# EAGLE design core (EAGLE 6.4)
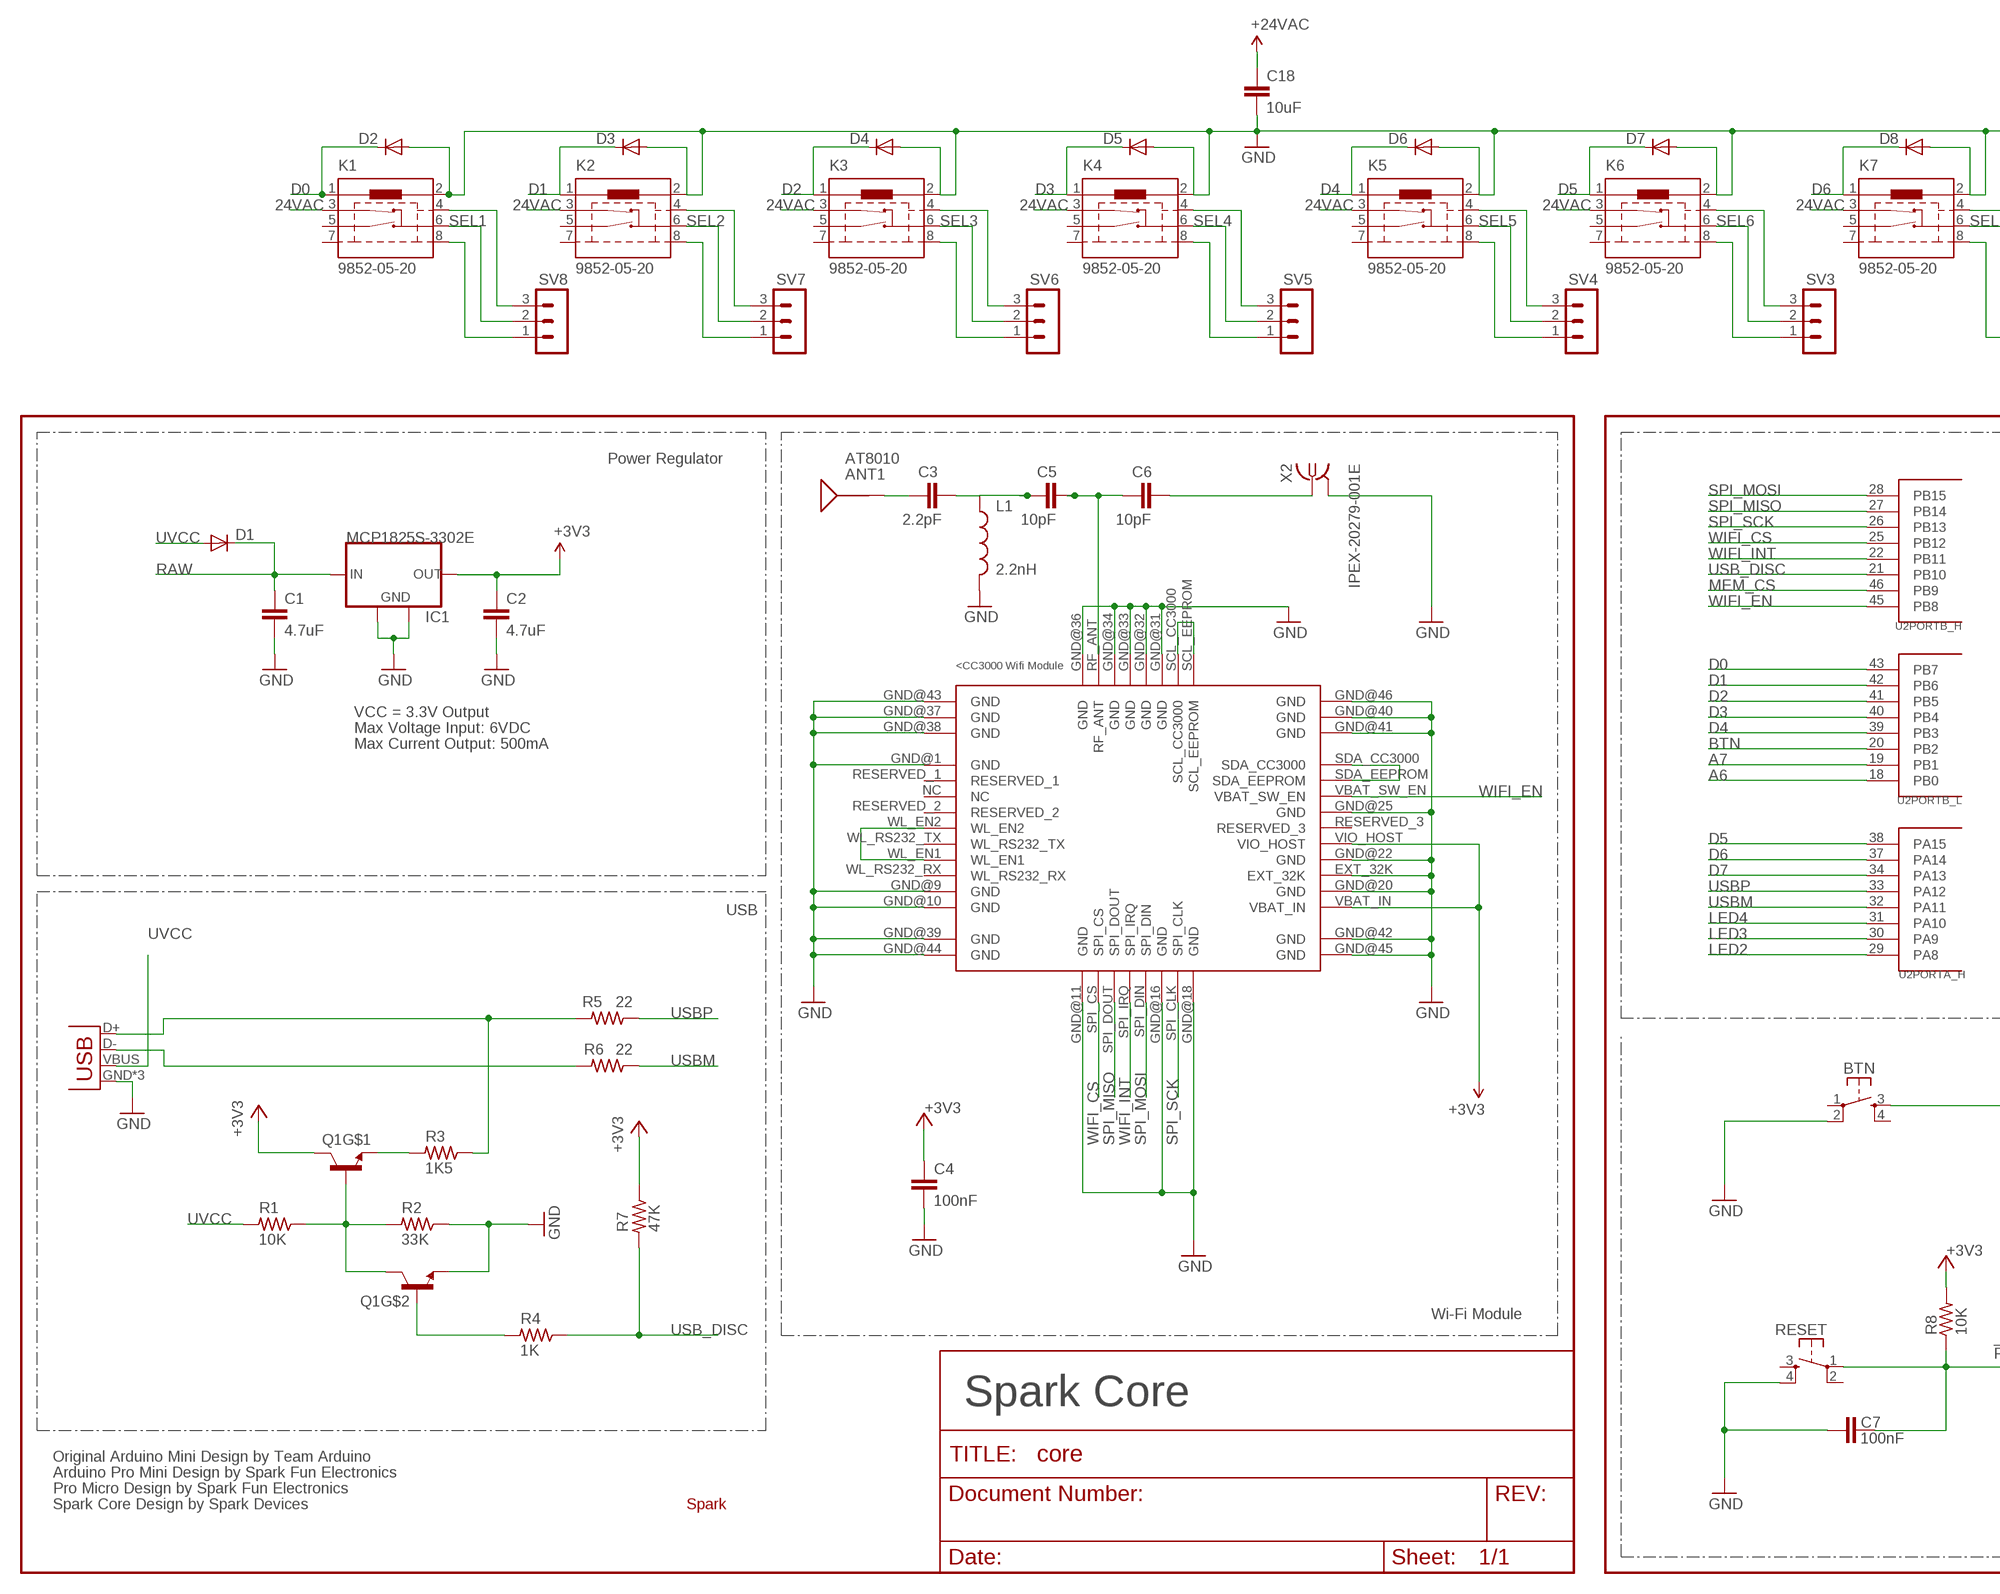
[diagram p0: schematic, sheet 1, part 1 of 2]
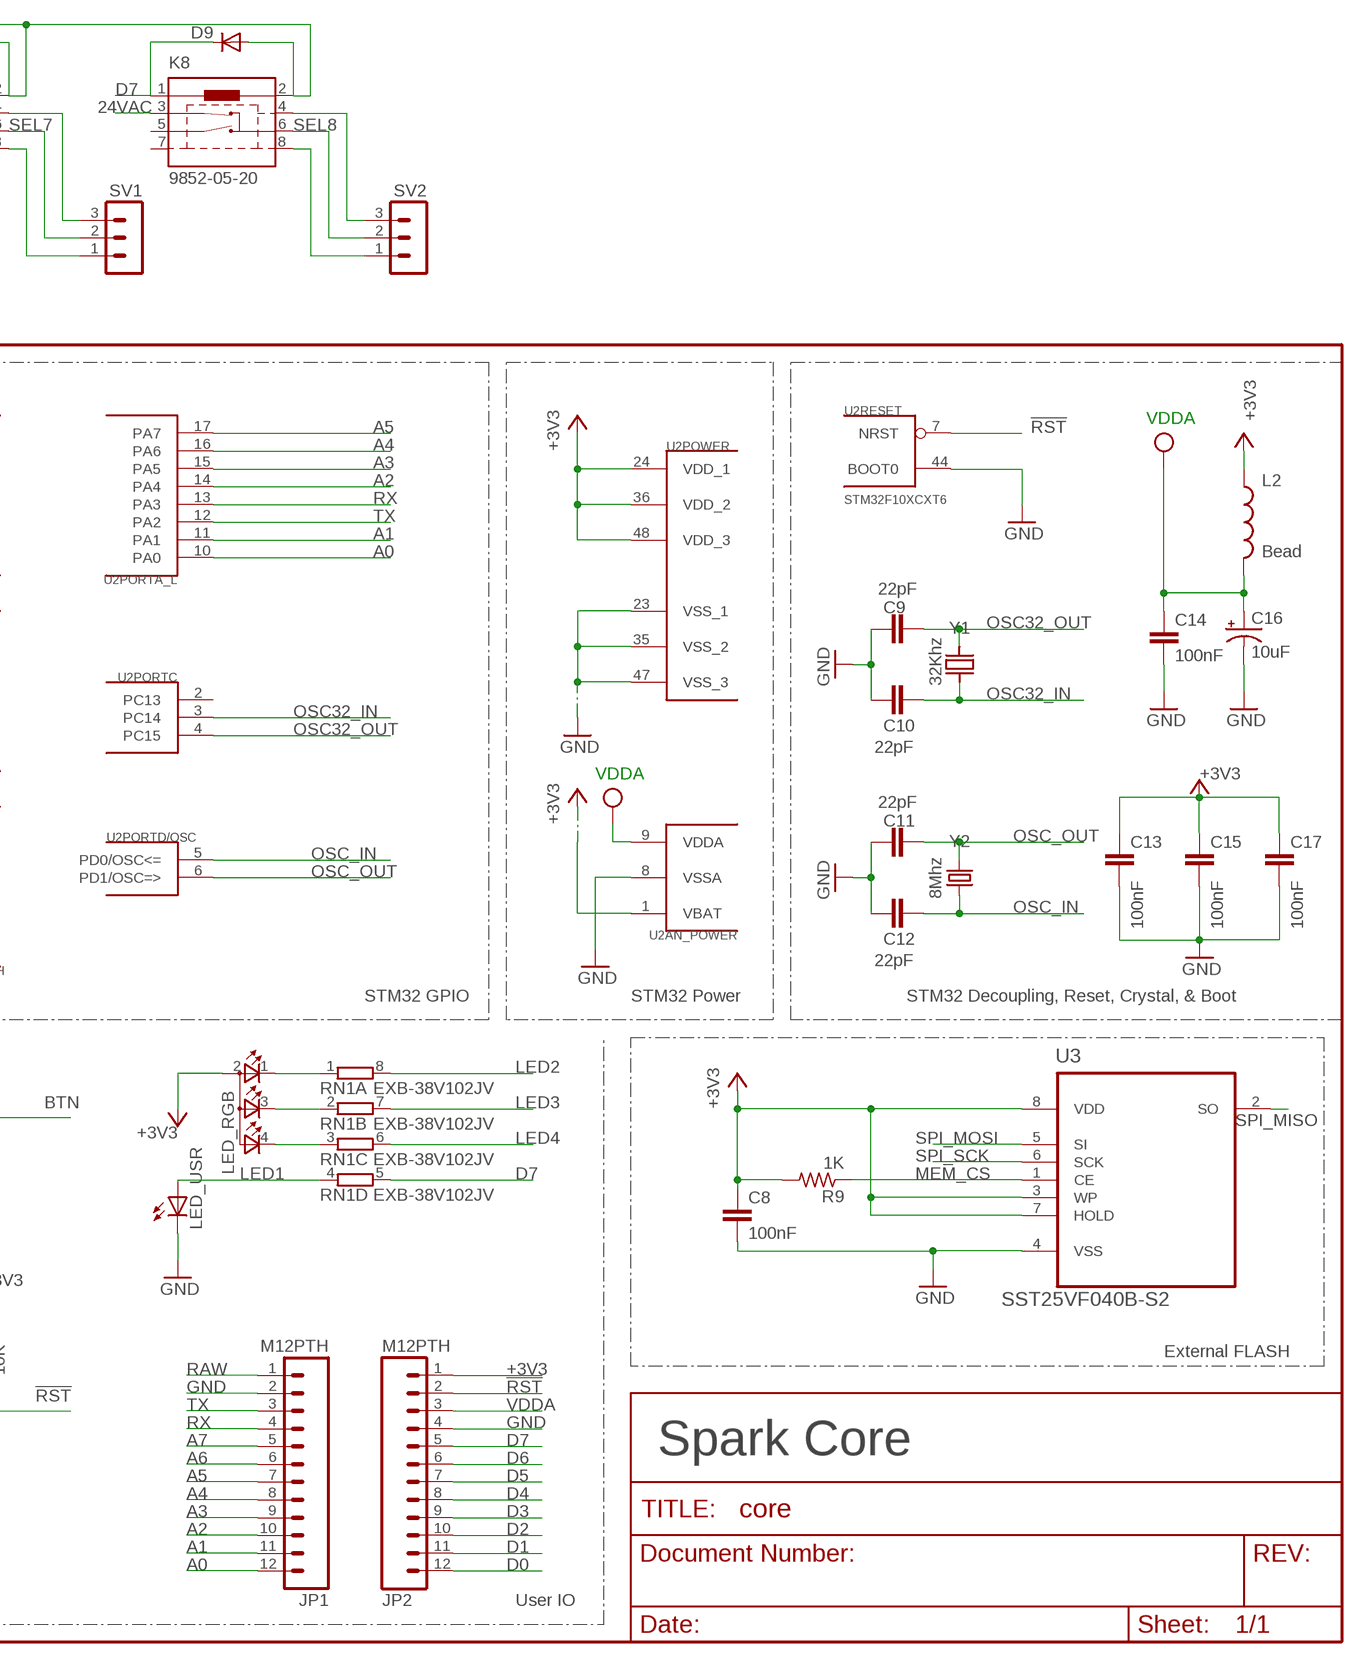
[diagram p1: schematic, sheet 1, part 2 of 2]

## Parts
ANT1  AT8010  [AT8010]
BTN  KMR211GLFS  TAC_SWITCHSMD  [TACTILE_SWITCH_SMD]
C1  4.7uF  C-EUC0603  [C0603]
C2  4.7uF  C-EUC0603  [C0603]
C3  2.2pF  C-EUC0603  [C0603]
C4  100nF  C-EUC0603  [C0603]
C5  10pF  C-EUC0603  [C0603]
C6  10pF  C-EUC0603  [C0603]
C7  100nF  C-EUC0603  [C0603]
C8  100nF  C-EUC0603  [C0603]
C9  22pF  C-EUC0603  [C0603]
C10  22pF  C-EUC0603  [C0603]
C11  22pF  C-EUC0603  [C0603]
C12  22pF  C-EUC0603  [C0603]
C13  100nF  C-EUC0603  [C0603]
C14  100nF  C-EUC0603  [C0603]
C15  100nF  C-EUC0603  [C0603]
C16  10uF  TANT-CAP1206  [EIA3216]
C17  100nF  C-EUC0603  [C0603]
C18  10uF  C-EUC0603  [C0603]
D1  DIODESOD  [SOD-323]
D2  DIODESOD  [SOD-323]
D3  DIODESOD  [SOD-323]
D4  DIODESOD  [SOD-323]
D5  DIODESOD  [SOD-323]
D6  DIODESOD  [SOD-323]
D7  DIODESOD  [SOD-323]
D8  DIODESOD  [SOD-323]
D9  DIODESOD  [SOD-323]
IC1  MCP1825S-3302E  MCP1825S-SOT223  [SOT223]
JP1  M12PTH  [1X12-SMALL-PADS]
JP2  M12PTH  [1X12-SMALL-PADS]
K1  9852-05-20  [9852-20]
K2  9852-05-20  [9852-20]
K3  9852-05-20  [9852-20]
K4  9852-05-20  [9852-20]
K5  9852-05-20  [9852-20]
K6  9852-05-20  [9852-20]
K7  9852-05-20  [9852-20]
K8  9852-05-20  [9852-20]
L1  2.2nH  INDUCTOR0603  [0603]
L2  Bead  INDUCTOR0603  [0603]
LED_RGB  TOPLED-3PLCC  [P-LCC-4-3]
LED_USR  LED0603  [LED-0603]
Q1  MMDT3904  [SOT363]
R1  10K  R-US_R0603  [R0603]
R2  33K  R-US_R0603  [R0603]
R3  1K5  R-US_R0603  [R0603]
R4  1K  R-US_R0603  [R0603]
R5  22  R-US_R0603  [R0603]
R6  22  R-US_R0603  [R0603]
R7  47K  R-US_R0603  [R0603]
R8  10K  R-US_R0603  [R0603]
R9  1K  R-US_R0603  [R0603]
RESET  KMR211GLFS  TAC_SWITCHSMD  [TACTILE_SWITCH_SMD]
RN1  EXB-38V102JV  4R-NEXB38V  [EXB38V]
SV1  MA03-1  [MA03-1]
SV2  MA03-1  [MA03-1]
SV3  MA03-1  [MA03-1]
SV4  MA03-1  [MA03-1]
SV5  MA03-1  [MA03-1]
SV6  MA03-1  [MA03-1]
SV7  MA03-1  [MA03-1]
SV8  MA03-1  [MA03-1]
U1  CC3000  [CC3000]
U2  STM32F10XCXT6  [TQFP48]
U3  SST25VF040B-S2  [SOIC127P790X216-8N]
U$1  SPARK_LOGO2  [SPARK_LOGO2]
X1  USB-MICROB  USBUSB-MICROB-SLOT-HOLE  [USB-MICROB-SLOT-HOLE]
X2  IPEX-20279-001E  [IPEX-20279-001E]
Y1  32Khz  Q_FC135  [FC135]
Y2  8Mhz  CRYSTAL5X3  [CRYSTAL-SMD-5X3]

## Nets
24VAC: C18.1 K1.3 K2.3 K3.3 K4.3 K5.3 K6.3 K7.3 K8.3 ; supply symbol labelled +24VAC
!RST: C7.2 JP2.2 R8.1 RESET.1 U2.7(RESET:NRST)
+3V3: C2.1 C4.1 C8.1 C13.1 C15.1 C17.1 IC1.3(OUT) JP2.1 L2.1 LED_RGB.2(A2) Q1.3(C) R7.1 R8.2 R9.2 U1.VBAT_IN U1.VIO_HOST U2.1(AN_POWER:VBAT) U2.24(POWER:VDD_1) U2.36(POWER:VDD_2) U2.48(POWER:VDD_3) U3.3(WP) U3.7(HOLD) U3.8(VDD)
A0: JP1.12 U2.10(PORTA_L:PA0)
A1: JP1.11 U2.11(PORTA_L:PA1)
A2: JP1.10 U2.14(PORTA_L:PA4)
A3: JP1.9 U2.15(PORTA_L:PA5)
A4: JP1.8 U2.16(PORTA_L:PA6)
A5: JP1.7 U2.17(PORTA_L:PA7)
A6: JP1.6 U2.18(PORTB_L:PB0)
A7: JP1.5 U2.19(PORTB_L:PB1)
BTN: BTN.3 U2.20(PORTB_L:PB2)
D0: D2.1(C) JP2.12 K1.1 U2.43(PORTB_L:PB7)
D1: JP2.11 K2.1 U2.42(PORTB_L:PB6)
D2: JP2.10 K3.1 U2.41(PORTB_L:PB5)
D3: JP2.9 K4.1 U2.40(PORTB_L:PB4)
D4: JP2.8 K5.1 U2.39(PORTB_L:PB3)
D5: JP2.7 K6.1 U2.38(PORTA_H:PA15)
D6: JP2.6 K7.1 U2.37(PORTA_H:PA14)
D7: JP2.5 K8.1 RN1.5 U2.34(PORTA_H:PA13)
D8: D3.1(C)
D9: D4.1(C)
D10: D5.1(C)
D11: D6.1(C)
D12: D7.1(C)
D13: D8.1(C)
D14: D9.1(C)
GND [vcc]: BTN.2 C1.2 C2.2 C4.2 C7.1 C8.2 C9.2 C10.2 C11.2 C12.2 C13.2 C14.2 C15.2 C16.C(-) C17.2 C18.2 D2.2(A) IC1.2(GND) IC1.4(GND) JP1.2 JP2.4 K1.2 K2.2 K3.2 K4.2 K5.2 K6.2 K7.2 K8.2 L1.2 LED_USR.C Q1.1(E) R2.1 RESET.4 U1.EXT_32K U1.GND@1(GND) U1.GND@9(GND) U1.GND@10(GND) U1.GND@11(GND) U1.GND@16(GND) U1.GND@18(GND) U1.GND@20(GND) U1.GND@22(GND) U1.GND@25(GND) U1.GND@31(GND) U1.GND@32(GND) U1.GND@33(GND) U1.GND@34(GND) U1.GND@36(GND) U1.GND@37(GND) U1.GND@38(GND) U1.GND@39(GND) U1.GND@40(GND) U1.GND@41(GND) U1.GND@42(GND) U1.GND@43(GND) U1.GND@44(GND) U1.GND@45(GND) U1.GND@46(GND) U2.8(AN_POWER:VSSA) U2.23(POWER:VSS_1) U2.35(POWER:VSS_2) U2.44(RESET:BOOT0) U2.47(POWER:VSS_3) U3.4(VSS) X1.GND X1.MT1(GND) X1.MT2(GND) X2.2@1(GND) X2.2@2(GND)
GND1 [vcc]: D3.2(A)
GND2 [vcc]: D4.2(A)
GND3 [vcc]: D5.2(A)
GND4 [vcc]: D6.2(A)
GND5 [vcc]: D7.2(A)
GND6 [vcc]: D8.2(A)
GND7 [vcc]: D9.2(A)
LED1: LED_USR.A RN1.4
LED2: RN1.8 U2.29(PORTA_H:PA8)
LED3: RN1.7 U2.30(PORTA_H:PA9)
LED4: RN1.6 U2.31(PORTA_H:PA10)
MEM_CS: R9.1 U2.46(PORTB_H:PB9) U3.1(CE)
N$1: R3.1 R5.2 X1.D+
N$2 [RF]: C6.2 X2.1
N$3 [RF]: ANT1.SIG(SIGNAL) C3.1
N$4 [RF]: C5.2 C6.1 U1.RF_ANT
N$5 [RF]: C3.2 C5.1 L1.1
N$6: R6.2 X1.D-
N$7: U1.SCL_CC3000 U1.SCL_EEPROM
N$8: Q1.2(B) R4.2
N$9: U1.WL_EN1 U1.WL_EN2
N$10: LED_RGB.1(CRED) RN1.1
N$12: LED_RGB.3(CBLUE) RN1.2
N$13: Q1.5(B) Q1.6(C) R1.1 R2.2
N$14: LED_RGB.4(CGREEN) RN1.3
N$15: U1.SDA_CC3000 U1.SDA_EEPROM
N$16: Q1.4(E) R3.2
N$17: K8.8 SV2.1
N$18: K8.4 SV2.3
N$19: K7.8 SV1.1
N$20: K7.4 SV1.3
N$21: K6.8 SV3.1
N$22: K6.4 SV3.3
N$23: K5.8 SV4.1
N$24: K5.4 SV4.3
N$25: K4.8 SV5.1
N$26: K4.4 SV5.3
N$27: K3.8 SV6.1
N$28: K3.4 SV6.3
N$29: K2.8 SV7.1
N$30: K2.4 SV7.3
N$31: K1.8 SV8.1
N$32: K1.4 SV8.3
OSC32_IN: C10.1 U2.3(PORTC:PC14) Y1.X1
OSC32_OUT: C9.1 U2.4(PORTC:PC15) Y1.X2
OSC_IN: C12.1 U2.5(PORTD/OSC:PD0/OSC<=) Y2.1
OSC_OUT: C11.1 U2.6(PORTD/OSC:PD1/OSC=>) Y2.3
RAW [vcc]: C1.1 D1.1(C) IC1.1(IN) JP1.1
RX: JP1.4 U2.13(PORTA_L:PA3)
SEL1: K1.6 SV8.2
SEL2: K2.6 SV7.2
SEL3: K3.6 SV6.2
SEL4: K4.6 SV5.2
SEL5: K5.6 SV4.2
SEL6: K6.6 SV3.2
SEL7: K7.6 SV1.2
SEL8: K8.6 SV2.2
SPI_MISO: U1.SPI_DOUT U2.27(PORTB_H:PB14) U3.2(SO)
SPI_MOSI: U1.SPI_DIN U2.28(PORTB_H:PB15) U3.5(SI)
SPI_SCK: U1.SPI_CLK U2.26(PORTB_H:PB13) U3.6(SCK)
TX: JP1.3 U2.12(PORTA_L:PA2)
USB_DISC: R4.1 R7.2 U2.21(PORTB_H:PB10)
USBM: R6.1 U2.32(PORTA_H:PA11)
USBP: R5.1 U2.33(PORTA_H:PA12)
UVCC: D1.2(A) R1.2 X1.VBUS
VDDA: C14.1 C16.A(+) JP2.3 L2.2 U2.9(AN_POWER:VDDA) ; supply symbol labelled VCC
WIFI_CS: U1.SPI_CS U2.25(PORTB_H:PB12)
WIFI_EN: U1.VBAT_SW_EN U2.45(PORTB_H:PB8)
WIFI_INT: U1.SPI_IRQ U2.22(PORTB_H:PB11)
Unconnected: BTN.1 BTN.4 K1.5 K1.7 K2.5 K2.7 K3.5 K3.7 K4.5 K4.7 K5.5 K5.7 K6.5 K6.7 K7.5 K7.7 K8.5 K8.7 RESET.2 RESET.3 U1.NC U1.RESERVED_1 U1.RESERVED_2 U1.RESERVED_3 U1.WL_RS232_RX U1.WL_RS232_TX U2.2(PORTC:PC13)

## Notes on the sheet
- Power Regulator
- VDDA
- VCC = 3.3V Output
- Max Voltage Input: 6VDC
- Max Current Output: 500mA
- VDDA
- USB
- STM32 GPIO | STM32 Power | STM32 Decoupling, Reset, Crystal, & Boot
- Wi-Fi Module | External FLASH
- Spark Core | Spark Core
- Original Arduino Mini Design by Team Arduino
- Arduino Pro Mini Design by Spark Fun Electronics
- Pro Micro Design by Spark Fun Electronics
- Spark Core Design by Spark Devices
- User IO

## Library data of the parts
ANT1 = Spark:AT8010: AT8010 Series Multilayer Chip Antenna
BTN RESET = Spark:TAC_SWITCH: SMD Tactiile Switch
C1-C15 C17 C18 = rcl:C-EU: CAPACITOR, European symbol
C16 = Spark:TANT-CAP: Tantalum SMT
D1-D9 = SparkFun:DIODE: Diode These are standard reverse protection diodes and small signal diodes. SMA package can handle up to about 1A. SOD-323 can handle about 200mA. What the SOD-323 package when ordering, there are some mfgs out there that are 5-pin packages.
IC1 = Spark:MCP1825S: 500 mA, Low Voltage, Low Quiescent Current LDO Regulator
JP1 JP2 = Spark:M12: Header 12 Standard 12-pin 0.1" header. Use with straight break away headers (SKU : PRT-00116), right angle break away headers (PRT-00553), swiss pins (PRT-00743), machine pins (PRT-00117), and female headers (PRT-00115).
K1-K8 = relay:9852: Surface Mount Reed Relays Source: COTO TECHNOLOGY - 9852-03-00 - RELAY - 91349.pdf; MPN: 9852-05-20; OC_FARNELL: 1081642; OC_NEWARK: 46M4523
L1 L2 = SparkFun-Passives:INDUCTOR: Inductors Basic Inductor/Choke - 0603 and 1206. Footprints are not proven and vary greatly between part numbers. SRN6045- 33uH, 20% 1.4A
LED_RGB = Spark:TOPLED-3: Cree CLVBA-FKA
LED_USR = SparkFun:LED: LEDs Standard schematic elements and footprints for 5mm, 3mm, 1206, and 0603 sized LEDs. 5mm - Spark Fun Electronics SKU : COM-00529 (and others)
Q1 = SparkFun-DiscreteSemi:MMDT3904: Dual NPN transistor
R1-R9 = rcl:R-US_: RESISTOR, American symbol
RN1 = resistor-dil:4R-N: Array Chip Resistor Source: RS Component / Phycomp; OC_FARNELL: unknown; OC_NEWARK: unknown
SV1-SV8 = con-lstb:MA03-1: PIN HEADER; OC_FARNELL: unknown; OC_NEWARK: unknown
U1 = CC3000:CC3000
U2 = stm32:STM32F10XCXT6: ST STM32F101/103 48pin LQFP
U3 = Spark:SST25VF040B: 4 Mbit SPI Serial Flash
U$1 = Spark:SPARK_LOGO2
X1 = Spark:USB
X2 = Spark:IPEX-20279-001E: Ultra Miniature Coaxial SMT RF Receptacle
Y1 = Spark:Q
Y2 = SparkFun-FreqCtrl:CRYSTAL: Various standard crystals. Proven footprints. Spark Fun Electronics SKU : COM-00534

## Net classes
2 RF: width 0.635 mm, clearance 0.762 mm

## Board
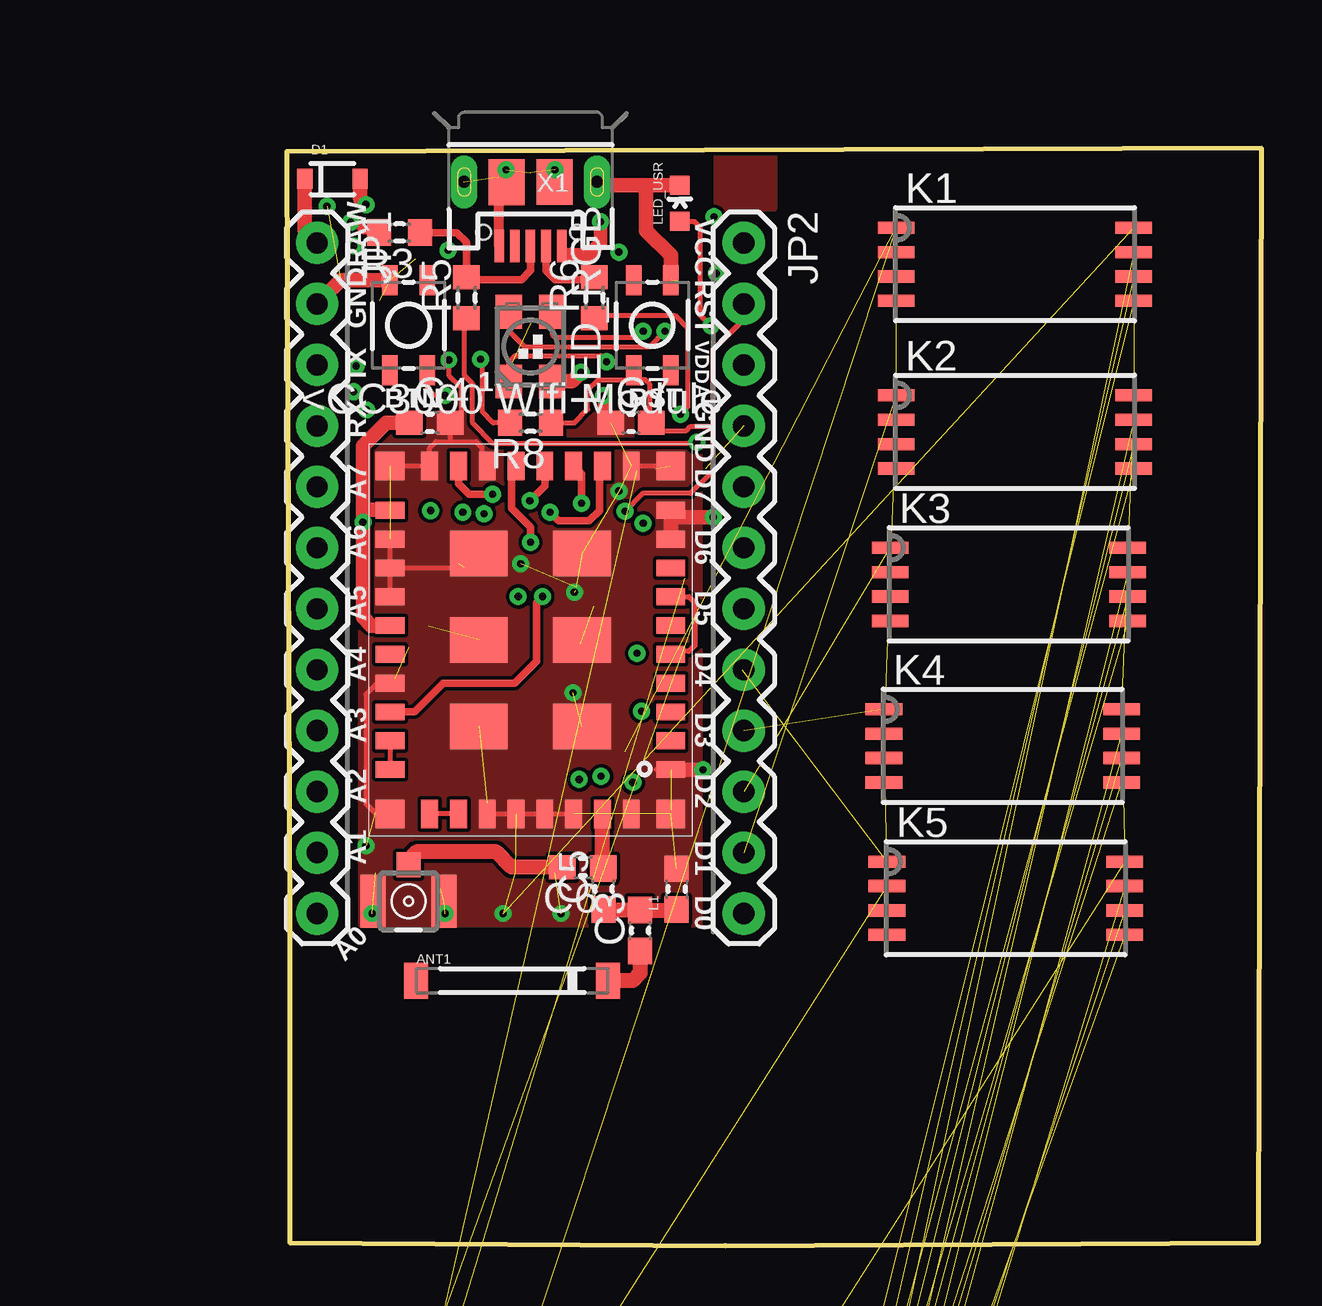
[diagram p2: board, top side]
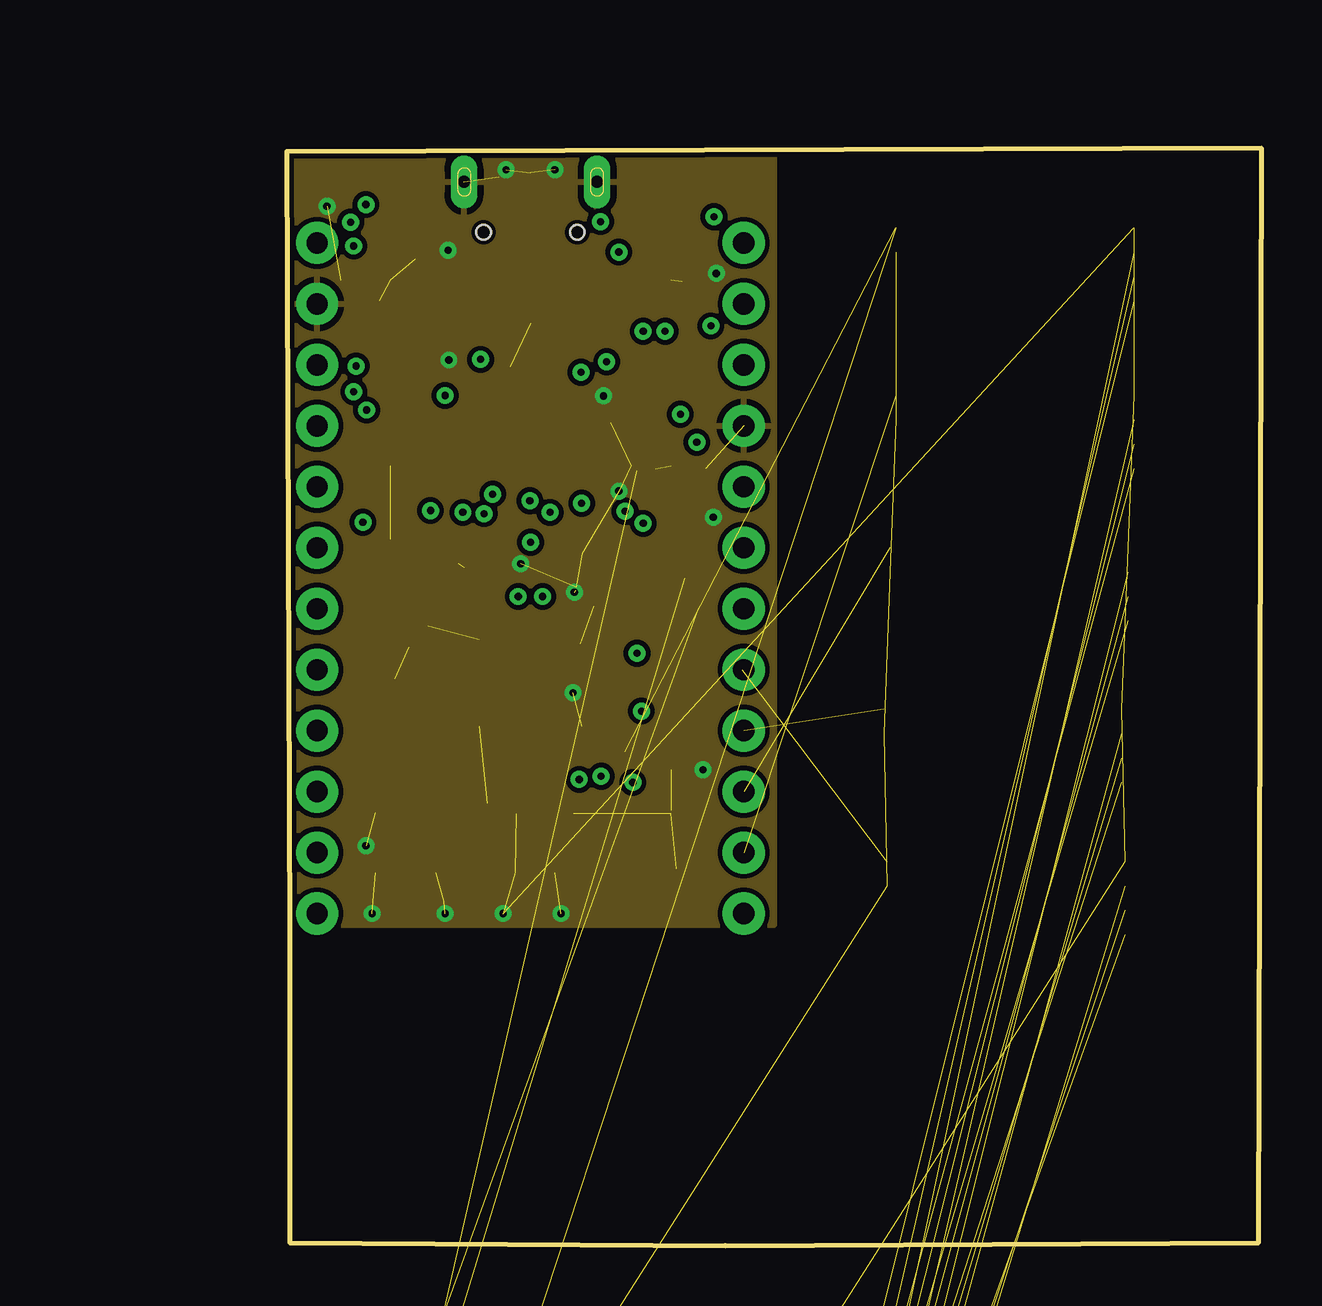
[diagram p3: board, inner layer $GND]
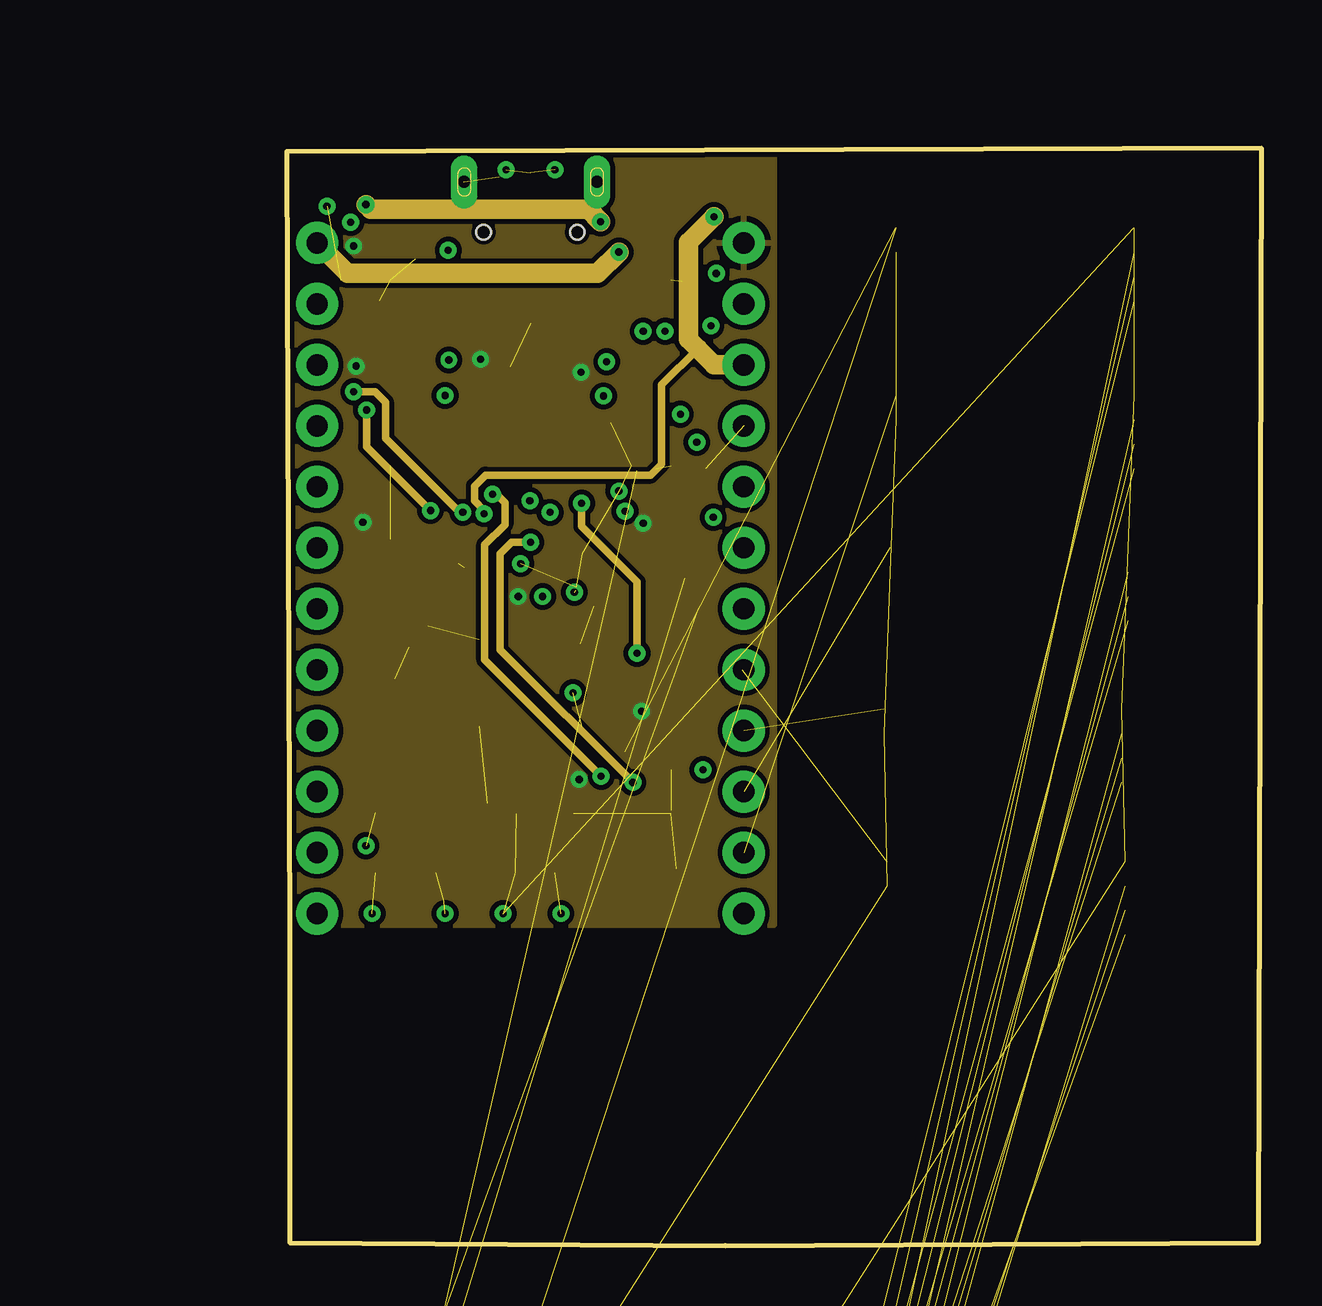
[diagram p4: board, inner layer $+3V3]
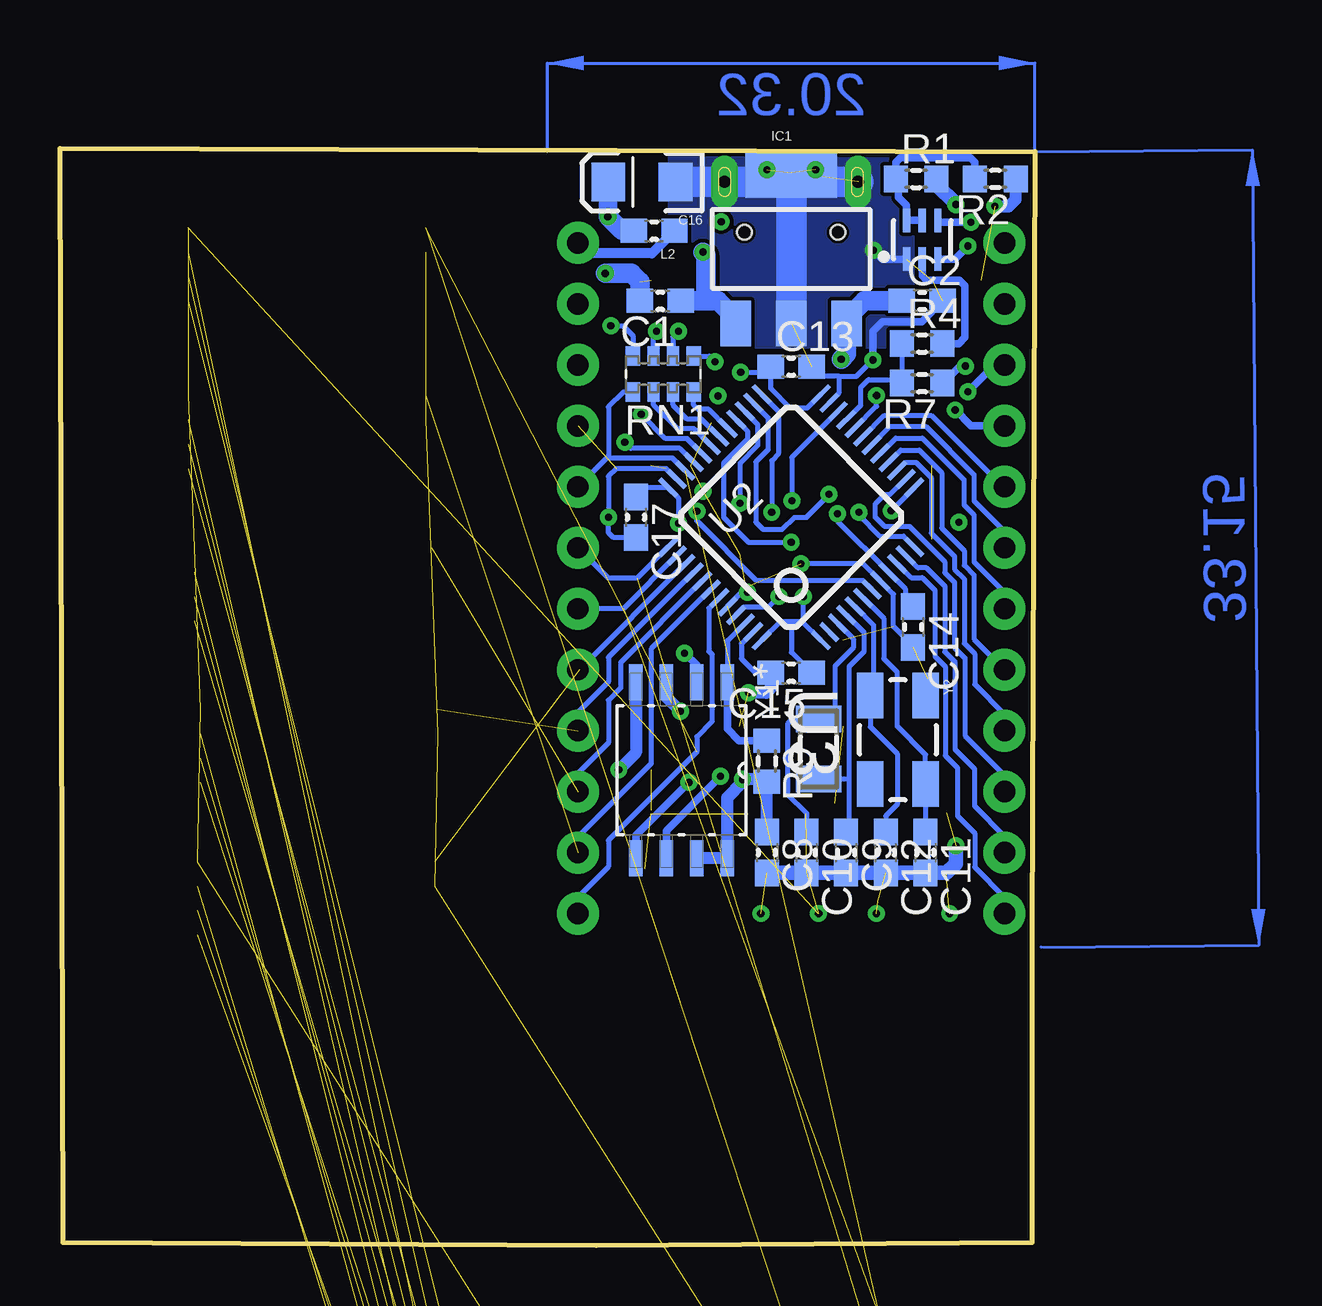
[diagram p5: board, bottom side, seen from below]

Size 40.64 x 45.72 mm. Coordinates in mm from the lower left corner, seen from the top.
Outline: 0,45.59 0.13,12.83 0.13,0.13 18.29,0 40.51,0.13 40.64,45.72 0,45.59
Copper layers (1+2*15+16): Top 0.035mm / dielectric 1.5mm / $GND 0.035mm / dielectric 0.15mm / $+3V3 0.035mm / dielectric 0.2mm / Bottom 0.035mm
Design rules "spark": minimum track width 6mil, minimum drill 0.3mm, track to track 6mil, track to pad 6mil, pad to pad 6mil, via to via 6mil, smd to smd 6mil, copper to edge 6mil, drill to drill 6mil, minimum pad ring 12mil, minimum via ring 8mil, stop-mask expansion 4mil, vias tented up to drill 20mil, thermal gap 10mil

### Footprints (pad centres in the part's own frame; a part is rotated, then mirrored left to right if it is on the bottom)
AT8010 = smd 1 x 1.5: NC -4,0; SIG 4,0
TACTILE_SWITCH_SMD = smd 1.25 x 0.65: 1 -1.875,0.775; 2 1.875,0.775; 3 -1.875,-0.775; 4 1.875,-0.775
C0603 = smd 1.1 x 1: 1 -0.85,0; 2 0.85,0
EIA3216 = smd 1.4 x 1.6: A 1.4,0; C -1.4,0
SOD-323 = smd 0.63 x 0.83: 1 -1.15,0; 2 1.15,0
SOT223 = smd 1.27 x 1.905: 1 -2.311,-3.099; 2 0,-3.099; 3 2.311,-3.099 | smd 3.81 x 1.905: 4 0,3.099
1X12-SMALL-PADS = drill 0.889 pad 1.753: 1 0,0; 2 2.54,0; 3 5.08,0; 4 7.62,0; 5 10.16,0; 6 12.7,0; 7 15.24,0; 8 17.78,0; 9 20.32,0; 10 22.86,0; 11 25.4,0; 12 27.94,0
9852-20 = smd 1.524 x 0.508: 1 -4.953,1.524; 2 4.953,1.524; 3 -4.953,0.508; 4 4.953,0.508; 5 -4.953,-0.508; 6 4.953,-0.508; 7 -4.953,-1.524; 8 4.953,-1.524
0603 = smd 1.1 x 1: 1 -0.85,0; 2 0.85,0
P-LCC-4-3 = smd 1.1 x 1.4: 1 -0.9,-1.45; 2 0.9,-1.45; 3 0.9,1.45; 4 -0.9,1.45
LED-0603 = smd 0.8 x 0.8: A 0,-0.75; C 0,0.75
SOT363 = smd 0.3 x 0.99: 1 -0.65,-0.8; 2 0,-0.8; 3 0.65,-0.8; 4 0.65,0.81; 5 0,0.81; 6 -0.65,0.81
R0603 = smd 1 x 1.1: 1 -0.85,0; 2 0.85,0
EXB38V = smd 0.6 x 0.8: 1 -1.275,-0.75; 4 1.275,-0.75; 5 1.275,0.75; 8 -1.275,0.75 | smd 0.5 x 0.8: 2 -0.4,-0.75; 3 0.4,-0.75; 6 0.4,0.75; 7 -0.4,0.75
MA03-1 = drill 1.016 long: 1 -2.54,0; 2 0,0; 3 2.54,0
CC3000 = smd 1.2 x 0.7: EXT_32K 5.85,-2.97; GND@1 -5.85,5.43; GND@9 -5.85,-4.17; GND@10 -5.85,-5.37; GND@20 5.85,-4.17; GND@22 5.85,-1.77; GND@25 5.85,1.83; NC -5.85,3.03; RESERVED_1 -5.85,4.23; RESERVED_2 -5.85,1.83; RESERVED_3 5.85,0.63; SDA_CC3000 5.85,5.43; SDA_EEPROM 5.85,4.23; VBAT_IN 5.85,-5.37; VBAT_SW_EN 5.85,3.03; VIO_HOST 5.85,-0.57; WL_EN1 -5.85,-1.77; WL_EN2 -5.85,0.63; WL_RS232_RX -5.85,-2.97; WL_RS232_TX -5.85,-0.57 | smd 0.7 x 1.2: GND@11 -4.2,-7.22; GND@16 1.8,-7.22; GND@18 4.2,-7.22; GND@31 1.8,7.28; GND@32 0.6,7.28; GND@33 -0.6,7.28; GND@34 -1.8,7.28; GND@36 -4.2,7.28; RF_ANT -3,7.28; SCL_CC3000 3,7.28; SCL_EEPROM 4.2,7.28; SPI_CLK 3,-7.22; SPI_CS -3,-7.22; SPI_DIN 0.6,-7.22; SPI_DOUT -1.8,-7.22; SPI_IRQ -0.6,-7.22 | smd 2.4 x 1.9: GND@37 -2.15,3.63; GND@38 -2.15,0.03; GND@39 -2.15,-3.57; GND@40 2.15,3.63; GND@41 2.15,0.03; GND@42 2.15,-3.57 | smd 1.2 x 1.2: GND@43 -5.85,7.28; GND@44 -5.85,-7.22; GND@45 5.85,-7.22; GND@46 5.85,7.28
TQFP48 = smd 0.2 x 1: 1 -2.75,-4.5; 2 -2.25,-4.5; 3 -1.75,-4.5; 4 -1.25,-4.5; 5 -0.75,-4.5; 6 -0.25,-4.5; 7 0.25,-4.5; 8 0.75,-4.5; 9 1.25,-4.5; 10 1.75,-4.5; 11 2.25,-4.5; 12 2.75,-4.5; 25 2.75,4.5; 26 2.25,4.5; 27 1.75,4.5; 28 1.25,4.5; 29 0.75,4.5; 30 0.25,4.5; 31 -0.25,4.5; 32 -0.75,4.5; 33 -1.25,4.5; 34 -1.75,4.5; 35 -2.25,4.5; 36 -2.75,4.5 | smd 1 x 0.2: 13 4.5,-2.75; 14 4.5,-2.25; 15 4.5,-1.75; 16 4.5,-1.25; 17 4.5,-0.75; 18 4.5,-0.25; 19 4.5,0.25; 20 4.5,0.75; 21 4.5,1.25; 22 4.5,1.75; 23 4.5,2.25; 24 4.5,2.75; 37 -4.5,2.75; 38 -4.5,2.25; 39 -4.5,1.75; 40 -4.5,1.25; 41 -4.5,0.75; 42 -4.5,0.25; 43 -4.5,-0.25; 44 -4.5,-0.75; 45 -4.5,-1.25; 46 -4.5,-1.75; 47 -4.5,-2.25; 48 -4.5,-2.75
SOIC127P790X216-8N = smd 1.499 x 0.559: 1 -3.658,1.905; 2 -3.658,0.635; 3 -3.658,-0.635; 4 -3.658,-1.905; 5 3.658,-1.905; 6 3.658,-0.635; 7 3.658,0.635; 8 3.658,1.905
USB-MICROB-SLOT-HOLE = smd 0.4 x 1.35: D+ 0,2.675; D- -0.65,2.675; GND 1.3,2.675; ID 0.65,2.675; VBUS -1.3,2.675 | drill 0.5 pad 1.1 long: MT1 -2.775,0; MT2 2.775,0 | smd 1.5 x 1.9: P$1 -1,0; P$2 1,0.01 | hole 0.6: -1.95,2.1; 1.95,2.1
IPEX-20279-001E = smd 1 x 1.05: 1 0,1.528 | smd 1.05 x 2.2: 2@1 -1.475,0; 2@2 1.475,0
FC135 = smd 1.1 x 1.9: X1 -1.25,0; X2 1.25,0
CRYSTAL-SMD-5X3 = smd 1.9 x 1.1: 1 -1.85,-1.15; 2 1.85,-1.15; 3 1.85,1.15; 4 -1.85,1.15

### Placement (x,y rotation side)
ANT1  9.4,11.05 0 top
BTN  5.08,38.35 90 top
C1  15.62,39.37 180 bottom
C2  4.7,39.37 0 bottom
C3  14.73,13.13 90 top
C4  5.97,34.29 0 top
C5  13.21,14.86 90 top
C6  12.34,15.77 180 top
C7  14.35,34.29 0 top
C8  11.18,16.38 270 bottom
C9  7.87,16.38 270 bottom
C10  9.53,16.38 270 bottom
C11  4.57,16.38 270 bottom
C12  6.22,16.38 270 bottom
C13  10.16,36.63 0 bottom
C14  5.08,25.78 270 bottom
C15  10.16,23.88 180 bottom
C16  16.38,44.32 180 bottom
C17  16.64,30.35 270 bottom
C18  -1.4,-46.35 0 top  (outside the outline)
D1  1.91,44.45 0 top
D2  -4.57,-52.32 0 top  (outside the outline)
D3  -4.57,-55.88 0 top  (outside the outline)
D4  -4.57,-58.55 0 top  (outside the outline)
D5  -4.57,-61.21 0 top  (outside the outline)
D6  -4.57,-63.88 0 top  (outside the outline)
D7  -4.57,-66.55 0 top  (outside the outline)
D8  -4.57,-69.22 0 top  (outside the outline)
D9  -4.57,-71.88 0 top  (outside the outline)
IC1  10.16,41.53 0 bottom
JP1  1.27,41.78 270 top
JP2  19.05,41.78 270 top
K1  30.35,40.89 0 top
K2  30.35,33.91 0 top
K3  30.1,27.56 0 top
K4  29.84,20.83 0 top
K5  29.97,14.48 0 top
K6  2.92,-28.07 0 top  (outside the outline)
K7  2.92,-34.8 0 top  (outside the outline)
K8  2.92,-41.53 0 top  (outside the outline)
L1  16.26,14.86 90 top
L2  15.88,42.29 180 bottom
LED_RGB  10.16,37.47 0 top
LED_USR  16.38,43.43 0 top
Q1  4.7,41.91 0 bottom
R1  4.95,44.45 0 bottom
R2  1.65,44.45 180 bottom
R3  4.7,42.21 180 top
R4  4.7,37.59 0 bottom
R5  7.49,39.5 90 top
R6  12.83,39.5 90 top
R7  4.7,35.94 180 bottom
R8  10.16,34.29 180 top
R9  11.18,20.19 270 bottom
RESET  15.24,38.35 90 top
RN1  15.49,36.32 180 bottom
SV1  -0.51,-81.79 0 top  (outside the outline)
SV2  -0.51,-76.33 0 top  (outside the outline)
SV3  -0.51,-87.25 0 top  (outside the outline)
SV4  -0.51,-92.71 0 top  (outside the outline)
SV5  -0.51,-98.17 0 top  (outside the outline)
SV6  -0.51,-103.63 0 top  (outside the outline)
SV7  -0.51,-109.09 0 top  (outside the outline)
SV8  -0.51,-114.55 0 top  (outside the outline)
U1  10.16,25.27 180 top
U2  10.16,30.35 45 bottom
U3  14.73,19.81 270 bottom
U$1  17.78,43.05 0 top
X1  10.16,44.32 180 top
X2  5.08,14.35 0 top
Y1  9.02,20.7 270 bottom
Y2  5.71,21.08 270 bottom

### Tracks (layer width: path | path; a pad name or v marks a point on that pad's centre or on a via)
24VAC  (8 unrouted)
!RST  (via drill 0.3)
  Top 0.203: 17.75,34.11 17.75,37.31 19.05,38.61 JP2.2 | 17.75,34.11 17.75,32.26 16.84,31.34 14.83,31.34 v14.1,30.61 | 17.75,34.11 17.73,34.14 16.84,34.14 16.66,33.96 15.53,33.96 C7.2 15.14,34.35 15.14,35.89 14.94,36.09 14.46,36.09 | R8.1 11.99,34.29 12.55,34.85 12.55,35.66 12.98,36.09 14.46,36.09 | 14.46,36.09 RESET.1
  Bottom 0.203: U2.7 7.17,27.71 11.61,27.71 14.1,30.2 v14.1,30.61
+3V3  (via drill 0.3)
  Top 0.203: R8.2 8.61,34.29 8.15,34.75 8.15,36.86 v8.08,36.93
  Top 0.61: U1.VIO_HOST 3.52,25.84 3.17,26.19 v3.17,30.15 3.17,30.66 | 3.17,30.66 3.17,33.33 4.14,34.29 C4.1 | U1.VBAT_IN 4.29,30.66 3.17,30.66 | LED_RGB.2 11.88,36.02 v12.27,36.4
  Bottom 0.203: U2.1 9.71,26.01 | 9.71,26.01 10.16,26.01 | 10.16,26.01 10.62,26.01 U2.48 | 10.16,26.01 10.16,24.73 C15.1 | U2.24 9.5,34.9 10.19,34.9 11.01,35.72 C13.1 11.24,36.4 v12.27,36.4 | C17.1 16.25,31.59 U2.36 14.86,31.16 v14.86,30.1 | 9.71,26.01 9.65,26.06 v9.65,27.05
  Bottom 0.305: R7.1 3.14,36.65 v2.9,36.65 | Q1.3 3.34,41.11 v2.79,41.66
  Bottom 0.406: L2.1 15.96,41.35 18.62,41.35 JP2.1
  Bottom 0.508: U3.7 U3.8 12.83,18.67 12.19,19.3 v12.19,19.43 11.6,19.43 11.34,19.18 R9.2 C8.1 | v14.78,22.28 15.37,22.86 U3.3
  Bottom 0.813: C2.1 7.11,39.37 7.85,38.63 IC1.3 7.85,37.16 v8.08,36.93
  pour $+3V3 (isolate 0.203): 0,45.59 20.32,45.59 20.32,13.34 0,13.34
A0
  Bottom 0.203: U2.10 5.17,27.84 4.7,27.84 4.17,27.3 4.17,24.56 3.73,24.13 3.73,20.42 3.23,19.91 3.23,17.91 2.52,17.2 2.52,15.77 1.27,14.53 JP1.12
A1
  Bottom 0.203: U2.11 4.87,28.25 4.52,28.25 3.76,27.48 3.76,24.74 3.33,24.31 3.33,20.68 2.52,19.86 2.52,18.31 1.27,17.07 JP1.11
A2
  Bottom 0.203: U2.14 6.04,31.29 6.27,31.29 6.66,30.91 6.66,30.35 6.27,29.97 5.23,29.97 3.76,28.5 3.76,28.04 3.35,27.63 3.35,24.92 2.92,24.49 2.92,21.26 1.27,19.61 JP1.10
A3
  Bottom 0.203: U2.15 5.4,32.64 4.95,32.64 4.32,32 4.32,29.69 3.35,28.73 3.35,28.19 2.95,27.79 2.95,25.09 2.52,24.66 2.52,23.39 1.27,22.15 JP1.9
A4
  Bottom 0.203: U2.16 5.6,33.15 4.83,33.15 3.89,32.21 3.89,29.9 2.95,28.96 2.95,28.35 2.54,27.94 2.54,25.27 JP1.8
A5
  Bottom 0.203: U2.17 5.8,33.66 4.7,33.66 2.95,31.9 2.95,30.86 2.54,30.46 2.54,28.5 1.27,27.23 JP1.7
A6
  Bottom 0.203: U2.18 6.02,34.14 4.55,34.14 2.54,32.13 2.54,31.04 1.27,29.77 JP1.6
A7
  Bottom 0.203: U2.19 6.27,34.59 4.32,34.59 1.35,31.62 JP1.5
BTN  (via drill 0.3)
  Top 0.203: 5.84,36.47 BTN.3 5.87,36.47 5.87,35.69 6.13,35.43 v6.6,35.43
  Bottom 0.203: U2.20 6.6,34.97 v6.6,35.43
D0  (2 unrouted)
  Bottom 0.203: JP2.12 19.05,14.53 17.78,15.8 17.78,16.89 14.1,20.57 14.1,21.21 13.46,21.84 13.46,24.64 13.59,24.77 13.59,26.57 U2.43
D1  (1 unrouted)
  Bottom 0.203: U2.42 16,24.87 16,20.09 19.05,17.04 JP2.11
D2  (1 unrouted)
  Bottom 0.203: U2.41 17.27,24.3 17.27,23.24 17.78,22.73 17.78,20.95 19.05,19.69 JP2.10
D3  (1 unrouted)
  Bottom 0.203: U2.40 17.77,24.51 17.78,24.51 17.78,23.5 19.05,22.23 JP2.9
D4  (1 unrouted)
  Bottom 0.203: U2.39 18.98,24 JP2.8
D5  (1 unrouted)
  Bottom 0.203: U2.38 17.15,26.54 JP2.7
D6  (1 unrouted)
  Bottom 0.203: U2.37 16.59,27.81 17.78,27.81 JP2.6
D7  (1 unrouted)
  Bottom 0.203: U2.34 15.1,32.82 17.86,32.82 | RN1.5 17.16,35.57 17.78,34.95 17.78,32.89 17.86,32.82 | 17.86,32.82 JP2.5
GND  (via drill 0.3)  (47 unrouted)
  Top 0.203: U1.GND@43 16.01,18.15 | U1.GND@1 15.4,19.84 | U1.GND@34 U1.GND@33 U1.GND@32 U1.GND@31 8.36,18.44 | U1.GND@22 U1.EXT_32K | U1.GND@45 U1.GND@18 | U1.GND@38 12.41,25.15 | U1.GND@25 4.49,23.62 3.94,23.62 3.3,22.99 3.3,18.41 3.68,18.03 4.27,18.03 U1.GND@46 | U1.GND@11 U1.GND@44 | U1.EXT_32K U1.GND@20 | U1.EXT_32K 7.41,28.24 U1.GND@42 | U1.GND@18 | 8.26,32 8.26,32.39 U1.GND@16 8.13,32.73 8.13,33.27 7.9,33.5 6.83,33.5 | U1.GND@18 5.96,33.24 6.22,33.5 6.83,33.5 | 6.83,33.5 6.82,33.52 C4.2 7.26,34.73 7.26,35.76 6.76,36.27 v6.76,36.91 | 12.06,27.3 12.06,27.43
  Top 0.406: X1.GND 8.86,44.55 v9.14,44.83
  Top 0.508: v13.21,35.41 13.21,34.58 C7.1
  Top 0.61: U1.GND@1 v17.34,19.84 v17.35,19.84 | U1.GND@9 U1.GND@10 16.3,30.35 v17.78,30.35 | RESET.4 16.02,41.26 14.99,42.29 14.99,44.18 | LED_USR.C 14.99,44.18 | 14.99,44.18 13.07,44.18 X1.MT1 | BTN.2 2.26,40.23 JP1.2
  Bottom 0.203: U2.35 15.37,32.39 17.45,32.39 17.78,32.05 v17.78,30.35 17.78,29.72 17.57,29.5 C17.2 | U2.47 12.24,25.09 12.24,24.46 11.66,23.88 C15.2 | 8.15,36.22 7.44,36.22 v6.76,36.91 | U2.23 8.15,35.54 8.15,36.22 | C14.2 5.08,24.99 5.89,25.81 5.89,27.15 U2.8 7.17,28.42 v9.75,28.42 | 8.15,36.22 8.9,36.22 C13.2 | U2.44 12.22,27.23 v11.99,27.23
  Bottom 0.305: 10.16,44.7 IC1.4 | Q1.1 6.36,41.11 v6.73,41.48 | C2.2 4.71,38.51 6.35,38.51 6.76,38.1 v6.76,36.91
  Bottom 0.508: U3.4 16.64,20.55 v17.35,19.84 | v11.94,23.04 11.2,23.04 11.01,23.23 C15.2 | v1.68,43.31 1.09,43.31 0.8,43.6 R2.1 0.81,44.44
  Bottom 0.61: C8.2 C10.2 C9.2 C12.2 C11.2 3.69,15.53 3.3,15.93 v3.3,16.66
  Bottom 0.813: C1.2 16.47,40.17 16.82,40.51 v17.91,40.51 | 10.16,44.83 IC1.4
  Bottom 1.27: IC1.2 IC1.4 | 7.37,44.32 X1.MT1 C16.C
  other vias: 3.56,13.84 6.6,13.84 9.02,13.84 11.43,13.84 13.84,31.45 11.18,44.83
  pour $GND (isolate 0.203): 0,45.59 20.32,45.59 20.32,13.34 0,13.34
  pour Top (no thermals): 3.05,13.34 3.05,34.67 17.27,34.67 17.27,13.34
  pour Bottom (no thermals): 5.08,45.59 15.24,45.59 15.24,37.47 5.08,37.47
LED1  (via drill 0.3)
  Top 0.203: LED_USR.A 16.98,42.68 17.22,42.44 17.22,38.79 v17.68,38.33
  Bottom 0.203: v17.68,38.33 17.17,38.33 16.76,37.92 RN1.4
LED2
  Bottom 0.203: U2.29 13.6,34.85 14.05,34.85 14.22,35.03 RN1.8
LED3
  Bottom 0.203: U2.30 13.9,34.44 14.5,34.44 15.09,35.03 RN1.7
LED4
  Bottom 0.203: U2.31 14.2,34.04 14.91,34.04 15.9,35.03 RN1.6
MEM_CS
  Bottom 0.203: U2.46 12.83,25.21 U3.1
  Bottom 0.305: U3.1 12.83,21.54 12.33,21.04 R9.1
N$1
  Top 0.305: R3.1 7.09,42.22 7.49,41.81 R5.2 7.58,40.26 9.78,40.26 10.16,40.64 X1.D+
N$2
  Top 0.635: C6.2 9.37,15.77 8.74,16.41 5.4,16.41 5.08,16.09 X2.1
N$3
  Top 0.635: C3.1 14.73,11.37 14.41,11.05 ANT1.SIG
N$4
  Top 0.406: 13.21,15.77 C6.1
  Top 0.635: C6.1 13.16,15.81 U1.RF_ANT | 13.21,15.77 C5.2
N$5
  Top 0.635: C5.1 14.71,14.01 C3.2 16.23,13.98 L1.1
N$6
  Top 0.305: R6.2 12.74,40.26 11.18,40.26 10.81,40.62 X1.D-
N$7
  Top 0.203: U1.SCL_CC3000 U1.SCL_EEPROM
N$8
  Bottom 0.305: Q1.2 4.7,40.41 4.52,40.23 3.15,40.23 2.92,40 2.92,37.85 3.17,37.59 R4.2
N$9
  Top 0.203: U1.WL_EN1 16.77,27.04 17.02,26.8 17.02,25.02 16.76,24.77 16.13,24.77 U1.WL_EN2
N$10  (via drill 0.3)
  Top 0.203: LED_RGB.1 9.26,36.82 9.53,37.08 13.08,37.08 v13.34,36.83
  Bottom 0.203: RN1.1 13.58,37.07 v13.34,36.83
N$11
  pour Top: 17.91,45.59 20.32,45.59 20.32,43.18 17.91,43.18
N$12  (via drill 0.3)
  Top 0.203: LED_RGB.3 11.06,37.96 11.18,37.85 14.61,37.85 v14.86,38.1
  Bottom 0.203: v14.86,38.1 15.09,37.87 RN1.2
N$13
  Bottom 0.305: Q1.5 Q1.6 5.35,43.35 5.69,43.69 5.69,44.34 R1.1 5.8,45.15 5.61,45.34 2.69,45.34 2.5,45.15 R2.2
N$14  (via drill 0.3)
  Top 0.203: LED_RGB.4 9.26,38.11 9.91,37.47 15.14,37.47 v15.77,38.1
  Bottom 0.203: RN1.3 15.89,37.98 v15.77,38.1
N$15
  Top 0.203: U1.SDA_EEPROM U1.SDA_CC3000
N$16  (via drill 0.3)
  Top 0.305: 3.76,42.22 R3.2 3.77,42.29 3.2,42.29 2.85,42.65 v2.67,42.65
  Bottom 0.305: Q1.4 3.98,42.65 v2.67,42.65
N$17  (1 unrouted)
N$18  (1 unrouted)
N$19  (1 unrouted)
N$20  (1 unrouted)
N$21  (1 unrouted)
N$22  (1 unrouted)
N$23  (1 unrouted)
N$24  (1 unrouted)
N$25  (1 unrouted)
N$26  (1 unrouted)
N$27  (1 unrouted)
N$28  (1 unrouted)
N$29  (1 unrouted)
N$30  (1 unrouted)
N$31  (1 unrouted)
N$32  (1 unrouted)
OSC32_IN
  Bottom 0.203: U2.3 7.57,25.29 7.57,24.92 8.33,24.16 8.33,22.3 8.43,22.2 8.77,22.2 Y1.X1 10.1,21.95 10.31,21.74 10.31,18.82 9.53,18.03 C10.1
OSC32_OUT
  Bottom 0.203: U2.4 7.14,25.56 7.14,24.74 7.75,24.13 7.75,19.46 7.75,19.45 | 7.75,19.45 7.75,17.36 C9.1 | Y1.X2 7.75,19.45
OSC_IN
  Bottom 0.203: U2.5 6.73,25.86 6.73,23.07 Y2.1 6.87,21.62 5.74,20.5 5.74,18.39 6.22,17.91 C12.1
OSC_OUT
  Bottom 0.203: U2.6 6.3,26.14 6.3,24.46 5.74,23.9 5.74,21.64 4.57,20.46 Y2.3 | 4.57,19.24 Y2.3 | Y2.3 C11.1
RAW  (via drill 0.3)
  Top 0.61: D1.1 0.76,42.3 JP1.1
  $+3V3 0.813: v13.84,41.4 12.95,40.51 2.54,40.51 JP1.1
  Bottom 0.813: IC1.1 12.47,38.63 13.21,39.37 13.72,39.37 | 13.72,39.37 C1.1 | v13.84,41.4 13.72,41.28 13.72,39.37
RX  (via drill 0.3)
  $+3V3 0.305: v3.33,34.82 3.33,33.3 v5.99,30.63
  Bottom 0.203: U2.13 v5.99,30.63
  Bottom 0.305: v3.33,34.82 2.67,34.16 JP1.4
SEL1  (1 unrouted)
SEL2  (1 unrouted)
SEL3  (1 unrouted)
SEL4  (1 unrouted)
SEL5  (1 unrouted)
SEL6  (1 unrouted)
SEL7  (1 unrouted)
SEL8  (1 unrouted)
SPI_MISO  (via drill 0.3)
  Top 0.305: U1.SPI_DOUT 12.29,32.16 v12.29,30.94
  $+3V3 0.305: v12.29,30.94 12.29,29.97 14.61,27.66 v14.61,24.69
  Bottom 0.203: U2.27 11.56,34.23 11.56,33.35 12.29,32.61 v12.29,30.94
  Bottom 0.305: U3.2 14.1,24.18 v14.61,24.69
SPI_MOSI  (via drill 0.3)
  Top 0.305: U1.SPI_DIN 9.37,32.31 9.37,30.73 10.16,29.95 v10.16,29.31
  $+3V3 0.305: v14.43,19.3 8.89,24.84 8.89,28.83 9.37,29.31 v10.16,29.31
  Bottom 0.203: U2.28 11.99,33.95 11.99,33.6 12.98,32.61 12.98,30.35 11.94,29.31 v10.16,29.31
  Bottom 0.305: U3.5 16.64,17.09 v14.43,19.3
SPI_SCK  (via drill 0.3)
  Top 0.305: U1.SPI_CLK 7.16,31.75 7.59,31.32 v8.59,31.32
  $+3V3 0.305: v13.11,19.56 8.26,24.41 8.26,29.21 9.09,30.05 9.09,30.96 8.74,31.32 v8.59,31.32
  Bottom 0.203: 8.59,31.24 v8.59,31.32 8.59,31.29 9.53,30.35 10.03,30.35 10.54,29.84 11.33,29.84 11.63,30.15 11.63,32.66 11.12,33.17 11.12,34.5 U2.26
  Bottom 0.305: U3.6 15.37,17.3 v13.11,19.56
TX  (via drill 0.3)
  $+3V3 0.305: v2.79,35.59 3.68,35.59 4.12,35.15 4.12,33.66 7.21,30.56 v7.34,30.56
  Bottom 0.203: U2.12 5.48,29.57 6.48,29.57 7.34,30.43 v7.34,30.56
  Bottom 0.305: v2.79,35.59 1.68,36.7 JP1.3
USB_DISC
  Bottom 0.203: U2.21 7.26,35.02 7.26,35.76 6.93,36.09 5.7,36.09 R7.2 R4.1
USBM  (via drill 0.3)
  Top 0.203: R6.1 12.94,38.76 16.18,38.76 16.71,38.23 16.71,34.95 v16.41,34.65
  Bottom 0.203: U2.32 14.5,33.63 15.39,33.63 v16.41,34.65
USBP  (via drill 0.3)
  Top 0.203: v17.09,33.48 17.04,33.43 8.61,33.43 7.75,34.29 7.75,35.92 7.42,36.25 7.42,38.57 R5.1
  Bottom 0.203: U2.33 14.8,33.22 16.84,33.22 v17.09,33.48
UVCC  (via drill 0.3)
  Top 0.305: 11.46,41.55 X1.VBUS
  Top 0.406: 11.73,41.3 11.71,41.3 11.46,41.55
  Top 0.559: 11.73,41.3 12.6,41.3 13.08,41.78 v13.08,42.67
  Top 0.61: D1.2 3.06,43.63 v3.3,43.38
  $+3V3 0.813: v13.08,42.67 12.57,43.18 3.5,43.18 v3.3,43.38
  Bottom 0.61: v3.3,43.38 3.3,43.41 4.1,44.21 R1.2
VDDA  (via drill 0.3)
  $+3V3 0.305: 17.13,37.38 15.62,35.87 15.62,32.56 15.16,32.11 8.28,32.11 7.82,31.65 7.82,31.04 8.23,30.63 v8.23,30.5
  $+3V3 0.813: v17.8,42.88 16.74,41.81 16.74,37.77 17.13,37.38 17.8,36.7 JP2.3
  Bottom 0.203: C14.1 5.41,26.96 5.41,27.37 U2.9 8.23,30.19 v8.23,30.5
  Bottom 0.762: C16.A 17.8,44.3 v17.8,42.88 17.22,42.29 L2.2
WIFI_CS  (via drill 0.3)
  Top 0.203: U1.SPI_CS 12.91,32.74
  Top 0.305: v10.97,30.56 11.33,30.2 12.6,30.2 13.03,30.63 13.03,32.36 U1.SPI_CS
  Bottom 0.203: U2.25 10.69,34.78 10.69,33 10.97,32.72 v10.97,30.56
WIFI_EN  (via drill 0.3)
  Top 0.203: 4.33,22.23 U1.VBAT_SW_EN
  Top 0.305: U1.VBAT_SW_EN 5.33,22.24 6.53,23.44 9.5,23.44 10.41,24.36 10.41,26.8 v10.67,27.05
  Bottom 0.203: U2.45 12.13,26.62 11.1,26.62 v10.67,27.05
WIFI_INT  (via drill 0.3)
  Top 0.305: v10.13,31.04 10.76,31.66 U1.SPI_IRQ
  Bottom 0.203: U2.22 10.13,32.85 v10.13,31.04
(copper drawn outside any net)
  shapes: Bottom area x2

### Text on the board
tPlace: VCC | RAW | RST | GND | VDDA | TX | GND | BTN | RST | RX | D7 | A7 | D6 | A6 | D5 | A5 | D4 | A4 | D3 | A3 | D2 | A2 | D1 | A1 | D0 | A0